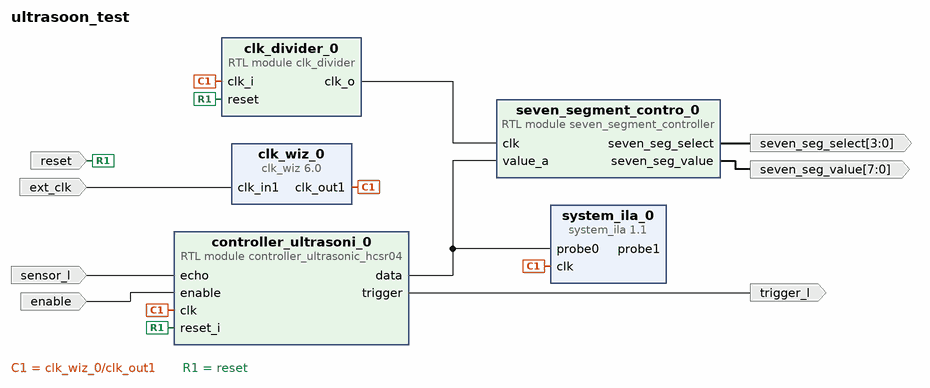
[diagram p0: block diagram of the top level]
# Vivado block design ultrasoon_test, xc7z020clg400-1, Vivado 2023.1
create_bd_design ultrasoon_test

create_bd_port -dir I -type clk ext_clk
set_property -dict {CONFIG.FREQ_HZ 12000000} [get_bd_ports ext_clk]
create_bd_port -dir I -type rst reset
set_property -dict {CONFIG.POLARITY ACTIVE_HIGH} [get_bd_ports reset]
create_bd_port -dir I enable
create_bd_port -dir I sensor_l
create_bd_port -dir O trigger_l
create_bd_port -dir O -from 3 -to 0 seven_seg_select
create_bd_port -dir O -from 7 -to 0 seven_seg_value

create_bd_cell -type ip -vlnv xilinx.com:ip:clk_wiz:6.0 clk_wiz_0
set_property -dict [list \
  CONFIG.CLKIN1_JITTER_PS 833.33 \
  CONFIG.CLKOUT1_JITTER 479.872 \
  CONFIG.CLKOUT1_PHASE_ERROR 668.310 \
  CONFIG.MMCM_CLKFBOUT_MULT_F 62.500 \
  CONFIG.MMCM_CLKIN1_PERIOD 83.333 \
  CONFIG.MMCM_CLKIN2_PERIOD 10.0 \
  CONFIG.MMCM_CLKOUT0_DIVIDE_F 7.500 \
  CONFIG.PRIM_IN_FREQ 12.000 \
  CONFIG.USE_LOCKED false \
  CONFIG.USE_RESET false \
] [get_bd_cells clk_wiz_0]
create_bd_cell -type ip -vlnv xilinx.com:ip:system_ila:1.1 system_ila_0
set_property -dict [list \
  CONFIG.C_DATA_DEPTH 131072 \
  CONFIG.C_MON_TYPE NATIVE \
  CONFIG.C_NUM_OF_PROBES 2 \
  CONFIG.C_PROBE0_TYPE 0 \
] [get_bd_cells system_ila_0]
create_bd_cell -type module -reference clk_divider clk_divider_0
set_property -dict {CONFIG.division 1000} [get_bd_cells clk_divider_0]
create_bd_cell -type module -reference seven_segment_controller seven_segment_contro_0
create_bd_cell -type module -reference controller_ultrasonic_hcsr04 controller_ultrasoni_0
set_property -dict {CONFIG.MaxDistance_mm 200 CONFIG.MinDistance_mm 0} [get_bd_cells controller_ultrasoni_0]

# ---- connections ----

connect_bd_net [get_bd_pins clk_divider_0/clk_o] [get_bd_pins seven_segment_contro_0/clk]
connect_bd_net -net clk_in1_0_1 [get_bd_ports ext_clk] [get_bd_pins clk_wiz_0/clk_in1]
connect_bd_net [get_bd_pins clk_wiz_0/clk_out1] \
  [get_bd_pins system_ila_0/clk] [get_bd_pins clk_divider_0/clk_i] [get_bd_pins controller_ultrasoni_0/clk]
connect_bd_net -net controller_ultrasoni_0_data [get_bd_pins controller_ultrasoni_0/data] \
  [get_bd_pins system_ila_0/probe0] [get_bd_pins seven_segment_contro_0/value_a]
# net controller_ultrasoni_0_distance_mm_o has one end: system_ila_0/probe1
connect_bd_net [get_bd_pins controller_ultrasoni_0/trigger] [get_bd_ports trigger_l]
connect_bd_net -net echo_0_1 [get_bd_ports sensor_l] [get_bd_pins controller_ultrasoni_0/echo]
connect_bd_net -net enable_0_1 [get_bd_ports enable] [get_bd_pins controller_ultrasoni_0/enable]
connect_bd_net -net reset_0_1 [get_bd_ports reset] [get_bd_pins clk_divider_0/reset] [get_bd_pins controller_ultrasoni_0/reset_i]
connect_bd_net [get_bd_pins seven_segment_contro_0/seven_seg_select] [get_bd_ports seven_seg_select]
connect_bd_net [get_bd_pins seven_segment_contro_0/seven_seg_value] [get_bd_ports seven_seg_value]
set_property HDL_ATTRIBUTE.DEBUG true [get_bd_nets controller_ultrasoni_0_data]
set_property HDL_ATTRIBUTE.MARK_DEBUG true [get_bd_nets controller_ultrasoni_0_data]

validate_bd_design
save_bd_design
